# EAGLE schematic LightRetaggioSchema (EAGLE 9.6.2)
CNAME: Opto Isolator; CREVISION: 1.2; DATECODE: 20210419; DESIGNER: Daniele Palumbo
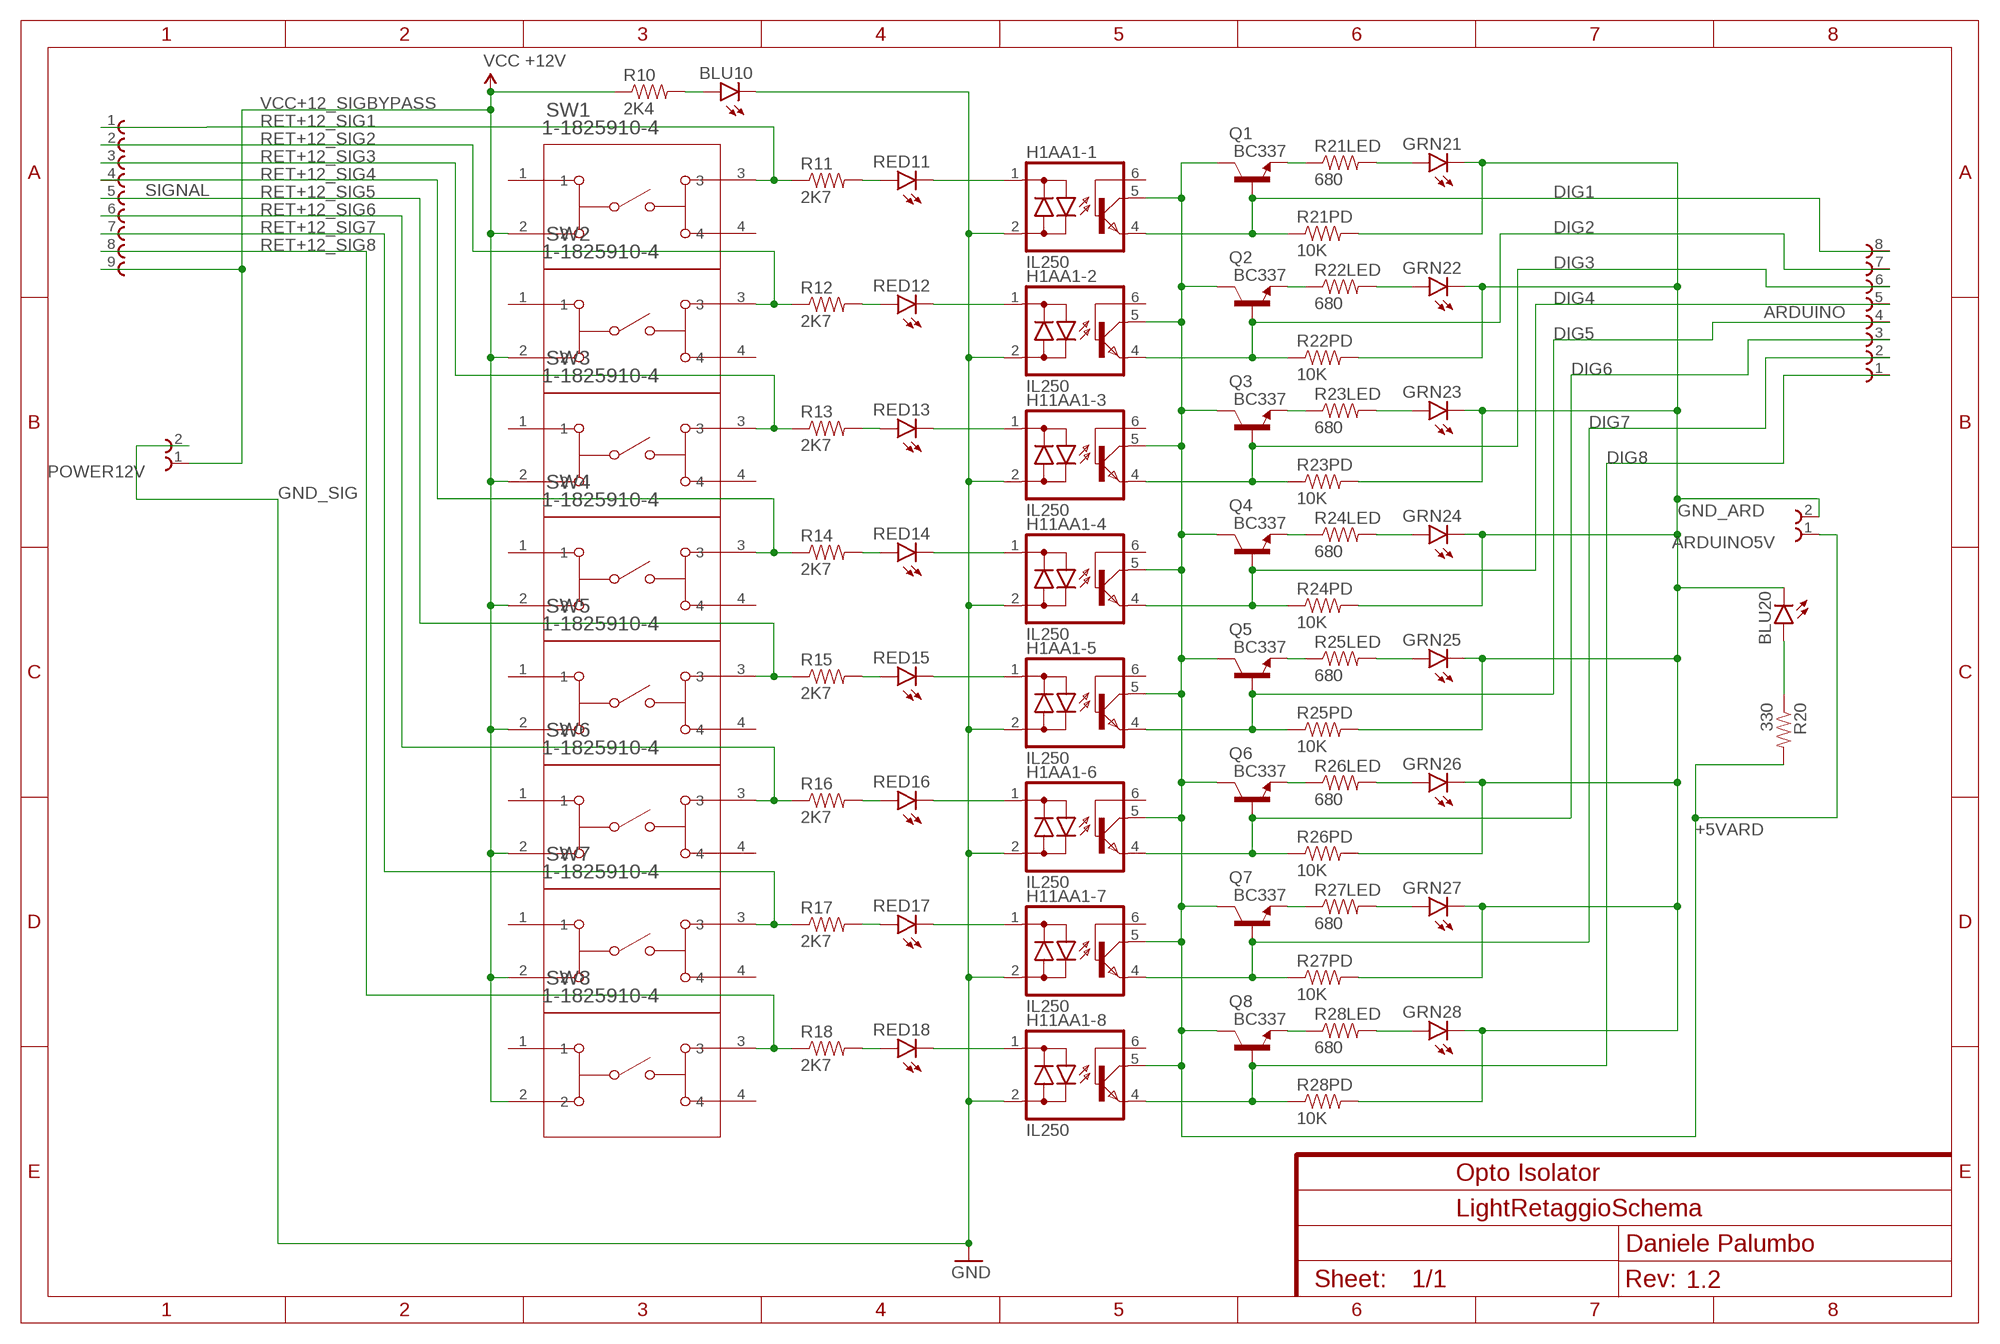
[diagram p0: schematic, sheet 1]

## Parts
ARDUINO  691311500108  [691311500108]
ARDUINO5V  691311500102  [691311500102]
BLU10  LED5MM  [LED5MM]
BLU20  LED5MM  [LED5MM]
GRN21  LED5MM  [LED5MM]
GRN22  LED5MM  [LED5MM]
GRN23  LED5MM  [LED5MM]
GRN24  LED5MM  [LED5MM]
GRN25  LED5MM  [LED5MM]
GRN26  LED5MM  [LED5MM]
GRN27  LED5MM  [LED5MM]
GRN28  LED5MM  [LED5MM]
H1AA1-1  IL250  [DIL06]
H1AA1-2  IL250  [DIL06]
H1AA1-5  IL250  [DIL06]
H1AA1-6  IL250  [DIL06]
H11AA1-3  IL250  [DIL06]
H11AA1-4  IL250  [DIL06]
H11AA1-7  IL250  [DIL06]
H11AA1-8  IL250  [DIL06]
POWER12V  691311500102  [691311500102]
Q1  BC337  TRANS_NPN-P2N2222A  [TO-92]
Q2  BC337  TRANS_NPN-P2N2222A  [TO-92]
Q3  BC337  TRANS_NPN-P2N2222A  [TO-92]
Q4  BC337  TRANS_NPN-P2N2222A  [TO-92]
Q5  BC337  TRANS_NPN-P2N2222A  [TO-92]
Q6  BC337  TRANS_NPN-P2N2222A  [TO-92]
Q7  BC337  TRANS_NPN-P2N2222A  [TO-92]
Q8  BC337  TRANS_NPN-P2N2222A  [TO-92]
R10  2K4  RESISTORPTH-1/4W  [AXIAL-0.4]
R11  2K7  RESISTORPTH-1/4W  [AXIAL-0.4]
R12  2K7  RESISTORPTH-1/4W  [AXIAL-0.4]
R13  2K7  RESISTORPTH-1/4W  [AXIAL-0.4]
R14  2K7  RESISTORPTH-1/4W  [AXIAL-0.4]
R15  2K7  RESISTORPTH-1/4W  [AXIAL-0.4]
R16  2K7  RESISTORPTH-1/4W  [AXIAL-0.4]
R17  2K7  RESISTORPTH-1/4W  [AXIAL-0.4]
R18  2K7  RESISTORPTH-1/4W  [AXIAL-0.4]
R20  330  RESISTORPTH-1/4W  [AXIAL-0.4]
R21LED  680  RESISTORPTH-1/4W  [AXIAL-0.4]
R21PD  10K  RESISTORPTH-1/4W  [AXIAL-0.4]
R22LED  680  RESISTORPTH-1/4W  [AXIAL-0.4]
R22PD  10K  RESISTORPTH-1/4W  [AXIAL-0.4]
R23LED  680  RESISTORPTH-1/4W  [AXIAL-0.4]
R23PD  10K  RESISTORPTH-1/4W  [AXIAL-0.4]
R24LED  680  RESISTORPTH-1/4W  [AXIAL-0.4]
R24PD  10K  RESISTORPTH-1/4W  [AXIAL-0.4]
R25LED  680  RESISTORPTH-1/4W  [AXIAL-0.4]
R25PD  10K  RESISTORPTH-1/4W  [AXIAL-0.4]
R26LED  680  RESISTORPTH-1/4W  [AXIAL-0.4]
R26PD  10K  RESISTORPTH-1/4W  [AXIAL-0.4]
R27LED  680  RESISTORPTH-1/4W  [AXIAL-0.4]
R27PD  10K  RESISTORPTH-1/4W  [AXIAL-0.4]
R28LED  680  RESISTORPTH-1/4W  [AXIAL-0.4]
R28PD  10K  RESISTORPTH-1/4W  [AXIAL-0.4]
RED11  LED5MM  [LED5MM]
RED12  LED5MM  [LED5MM]
RED13  LED5MM  [LED5MM]
RED14  LED5MM  [LED5MM]
RED15  LED5MM  [LED5MM]
RED16  LED5MM  [LED5MM]
RED17  LED5MM  [LED5MM]
RED18  LED5MM  [LED5MM]
SIGNAL  691311500109  [691311500109]
SW1  1-1825910-4  [SW4_1825910-D]
SW2  1-1825910-4  [SW4_1825910-D]
SW3  1-1825910-4  [SW4_1825910-D]
SW4  1-1825910-4  [SW4_1825910-D]
SW5  1-1825910-4  [SW4_1825910-D]
SW6  1-1825910-4  [SW4_1825910-D]
SW7  1-1825910-4  [SW4_1825910-D]
SW8  1-1825910-4  [SW4_1825910-D]

## Nets
+5VARD: ARDUINO5V.1 H1AA1-1.5(C) H1AA1-2.5(C) H1AA1-5.5(C) H1AA1-6.5(C) H11AA1-3.5(C) H11AA1-4.5(C) H11AA1-7.5(C) H11AA1-8.5(C) Q1.1(C) Q2.1(C) Q3.1(C) Q4.1(C) Q5.1(C) Q6.1(C) Q7.1(C) Q8.1(C) R20.P$2
DIG1: ARDUINO.8 H1AA1-1.4(E) Q1.2(B) R21PD.P$1
DIG2: ARDUINO.7 H1AA1-2.4(E) Q2.2(B) R22PD.P$1
DIG3: ARDUINO.6 H11AA1-3.4(E) Q3.2(B) R23PD.P$1
DIG4: ARDUINO.5 H11AA1-4.4(E) Q4.2(B) R24PD.P$1
DIG5: ARDUINO.4 H1AA1-5.4(E) Q5.2(B) R25PD.P$1
DIG6: ARDUINO.3 H1AA1-6.4(E) Q6.2(B) R26PD.P$1
DIG7: ARDUINO.2 H11AA1-7.4(E) Q7.2(B) R27PD.P$1
DIG8: ARDUINO.1 H11AA1-8.4(E) Q8.2(B) R28PD.P$1
GND_ARD: ARDUINO5V.2 BLU20.K(C) GRN21.K(C) GRN22.K(C) GRN23.K(C) GRN24.K(C) GRN25.K(C) GRN26.K(C) GRN27.K(C) GRN28.K(C) R21PD.P$2 R22PD.P$2 R23PD.P$2 R24PD.P$2 R25PD.P$2 R26PD.P$2 R27PD.P$2 R28PD.P$2
GND_SIG [ground]: BLU10.K(C) H1AA1-1.2(AC2) H1AA1-2.2(AC2) H1AA1-5.2(AC2) H1AA1-6.2(AC2) H11AA1-3.2(AC2) H11AA1-4.2(AC2) H11AA1-7.2(AC2) H11AA1-8.2(AC2) POWER12V.2 ; supply symbol labelled GND
N$1: BLU10.A R10.P$2
N$2: BLU20.A R20.P$1
N$3: H11AA1-8.1(AC1) RED18.K(C)
N$4: H11AA1-7.1(AC1) RED17.K(C)
N$5: H1AA1-6.1(AC1) RED16.K(C)
N$6: H1AA1-5.1(AC1) RED15.K(C)
N$7: Q1.3(E) R21LED.P$1
N$8: GRN21.A R21LED.P$2
N$9: H11AA1-4.1(AC1) RED14.K(C)
N$10: Q2.3(E) R22LED.P$1
N$11: GRN22.A R22LED.P$2
N$12: Q3.3(E) R23LED.P$1
N$13: GRN23.A R23LED.P$2
N$14: Q4.3(E) R24LED.P$1
N$15: GRN24.A R24LED.P$2
N$16: R13.P$2 RED13.A
N$17: H11AA1-3.1(AC1) RED13.K(C)
N$18: R14.P$2 RED14.A
N$19: R12.P$2 RED12.A
N$20: R11.P$2 RED11.A
N$21: R17.P$2 RED17.A
N$22: R18.P$2 RED18.A
N$23: R16.P$2 RED16.A
N$24: R15.P$2 RED15.A
N$25: Q5.3(E) R25LED.P$1
N$26: GRN25.A R25LED.P$2
N$27: Q6.3(E) R26LED.P$1
N$28: GRN26.A R26LED.P$2
N$29: Q7.3(E) R27LED.P$1
N$30: GRN27.A R27LED.P$2
N$31: Q8.3(E) R28LED.P$1
N$32: GRN28.A R28LED.P$2
N$33: H1AA1-2.1(AC1) RED12.K(C)
N$34: H1AA1-1.1(AC1) RED11.K(C)
RET+12_SIG1: R11.P$1 SIGNAL.1 SW1.3
RET+12_SIG2: R12.P$1 SIGNAL.2 SW2.3
RET+12_SIG3: R13.P$1 SIGNAL.3 SW3.3
RET+12_SIG4: R14.P$1 SIGNAL.4 SW4.3
RET+12_SIG5: R15.P$1 SIGNAL.5 SW5.3
RET+12_SIG6: R16.P$1 SIGNAL.6 SW6.3
RET+12_SIG7: R17.P$1 SIGNAL.7 SW7.3
RET+12_SIG8: R18.P$1 SIGNAL.8 SW8.3
VCC+12_SIGBYPASS [power]: POWER12V.1 R10.P$1 SIGNAL.9 SW1.2 SW2.2 SW3.2 SW4.2 SW5.2 SW6.2 SW7.2 SW8.2 ; supply symbol labelled VCC +12V
Unconnected: H1AA1-1.6(B) H1AA1-2.6(B) H1AA1-5.6(B) H1AA1-6.6(B) H11AA1-3.6(B) H11AA1-4.6(B) H11AA1-7.6(B) H11AA1-8.6(B) SW1.1 SW1.4 SW2.1 SW2.4 SW3.1 SW3.4 SW4.1 SW4.4 SW5.1 SW5.4 SW6.1 SW6.4 SW7.1 SW7.4 SW8.1 SW8.4

## Library data of the parts
ARDUINO = Wurth_Elektronik_Electromechanic_Terminal_Blocks_Connectors_rev19d:691311500108: WR-TBL Serie 311 - 5.08 mm Close Vertical PCB Header , 8 Pins=>Code : Con_TBL_Pluggable_5.08_PCB_THT_Simple_V_691311500108 <http://katalog.we-online.de/media/images/eican/Con_TBL_Pluggable_5.08_PCB_THT_Simple_V_6913115001xx_pf2.jpg> Details see: http://katalog.we-online.de/en/em/TBL_5_08_311_CLOSE_VERTICAL_PCB_HEADER_6913115001XX Created 2014-06-23, Karrer Zheng 2014 (C) Würth Elektronik; OC_FARNELL: unknown
ARDUINO5V POWER12V = Wurth_Elektronik_Electromechanic_Terminal_Blocks_Connectors_rev19d:691311500102: WR-TBL Serie 311 - 5.08 mm Close Vertical PCB Header , 2 Pins=>Code : Con_TBL_Pluggable_5.08_PCB_THT_Simple_V_691311500102 <http://katalog.we-online.de/media/images/eican/Con_TBL_Pluggable_5.08_PCB_THT_Simple_V_6913115001xx_pf2.jpg> Details see: http://katalog.we-online.de/en/em/TBL_5_08_311_CLOSE_VERTICAL_PCB_HEADER_6913115001XX Created 2014-06-23, Karrer Zheng 2014 (C) Würth Elektronik; MF: WURTH ELEKTRONIK; MPN: 691311500102; OC_FARNELL: 1641978
BLU10 BLU20 GRN21-GRN28 RED11-RED18 = led:LED: LED OSRAM: - CHIPLED LG R971, LG N971, LY N971, LG Q971, LY Q971, LO R971, LY R971 LH N974, LH R974 LS Q976, LO Q976, LY Q976 LO Q996 - Hyper CHIPLED LW Q18S LB Q993, LB Q99A, LB R99A - SideLED LS A670, LO A670, LY A670, LG A670, LP A670 LB A673, LV A673, LT A673, LW A673 LH A674 LY A675 LS A676, LA A676, LO A676, LY A676, LW A676 LS A679, LY A679, LG A679 - Hyper Micro SIDELED® LS Y876, LA Y876, LO Y876, LY Y876 LT Y87S - SmartLED LW L88C, LW L88S LB L89C, LB L89S, LG L890 LS L89K, LO L89K, LY L89K LS L896, LA L896, LO L896, LY L896 - TOPLED LS T670, LO T670, LY T670, LG T670, LP T670 LSG T670, LSP T670, LSY T670, LOP T670, LYG T670 LG T671, LOG T671, LSG T671 LB T673, LV T673, LT T673, LW T673 LH T674 LS T676, LA T676, LO T676, LY T676, LB T676, LH T676, LSB T676, LW T676 LB T67C, LV T67C, LT T67C, LS T67K, LO T67K, LY T67K, LW E67C LS E67B, LA E67B, LO E67B, LY E67B, LB E67C, LV E67C, LT E67C LW T67C LS T679, LY T679, LG T679 LS T770, LO T770, LY T770, LG T770, LP T770 LB T773, LV T773, LT T773, LW T773 LH T774 LS E675, LA E675, LY E675, LS T675 LS T776, LA T776, LO T776, LY T776, LB T776 LHGB T686 LT T68C, LB T68C - Hyper Mini TOPLED® LB M676 - Mini TOPLED Santana® LG M470 LS M47K, LO M47K, LY M47K Source: http://www.osram.convergy.de LUXEON: - LUMILED® LXK2-PW12-R00, LXK2-PW12-S00, LXK2-PW14-U00, LXK2-PW14-V00 LXK2-PM12-R00, LXK2-PM12-S00, LXK2-PM14-U00 LXK2-PE12-Q00, LXK2-PE12-R00, LXK2-PE12-S00, LXK2-PE14-T00, LXK2-PE14-U00 LXK2-PB12-K00, LXK2-PB12-L00, LXK2-PB12-M00, LXK2-PB14-N00, LXK2-PB14-P00, LXK2-PB14-Q00 LXK2-PR12-L00, LXK2-PR12-M00, LXK2-PR14-Q00, LXK2-PR14-R00 LXK2-PD12-Q00, LXK2-PD12-R00, LXK2-PD12-S00 LXK2-PH12-R00, LXK2-PH12-S00 LXK2-PL12-P00, LXK2-PL12-Q00, LXK2-PL12-R00 Source: www.luxeon.com KINGBRIGHT: KA-3528ASYC Source: www.kingbright.com; MF: ALCOSWITCH - TE CONNECTIVITY; MPN: FSM8JH; OC_FARNELL: 1555985
H1AA1-1 H1AA1-2 H1AA1-5 H1AA1-6 H11AA1-3 H11AA1-4 H11AA1-7 H11AA1-8 = optocoupler:IL250: SIEMENS OPTO COUPLER; MF: VISHAY/TELEFUNKEN; MPN: IL250; OC_FARNELL: unknown; OC_NEWARK: 58K1705
Q1-Q8 = SparkFun-DiscreteSemi:TRANS_NPN: NPN transistor Current controlled devices typically used to amplify current or used as a switch. BC547 - COM-08928 <http://www.sparkfun.com/products/8928> (TO-92 45V 100mA) (1.Collector 2.Base 3.Emitter) 2N3904 - COM-00521 <http://www.sparkfun.com/products/521> (TO-92 40V 200mA) (1.Emitter 2.Base 3.Collector) P2N2222A - COM-12852 <http://www.sparkfun.com/products/12852> (TO-92 40V 600mA) (1.Collector 2.Base 3.Emitter); OC_FARNELL: unknown; PROD_ID: TRANS-09536; VALUE: 600mA/40V
R10-R18 R20 R21LED R21PD R22LED R22PD R23LED R23PD R24LED R24PD R25LED R25PD R26LED R26PD R27LED R27PD R28LED R28PD = SparkFun-Passives:RESISTOR: Resistor Basic schematic elements and footprints for 0603, 1206, and PTH resistors.; OC_FARNELL: unknown
SIGNAL = Wurth_Elektronik_Electromechanic_Terminal_Blocks_Connectors_rev19d:691311500109: WR-TBL Serie 311 - 5.08 mm Close Vertical PCB Header , 9 Pins=>Code : Con_TBL_Pluggable_5.08_PCB_THT_Simple_V_691311500109 <http://katalog.we-online.de/media/images/eican/Con_TBL_Pluggable_5.08_PCB_THT_Simple_V_6913115001xx_pf2.jpg> Details see: http://katalog.we-online.de/en/em/TBL_5_08_311_CLOSE_VERTICAL_PCB_HEADER_6913115001XX Created 2014-06-23, Karrer Zheng 2014 (C) Würth Elektronik; OC_FARNELL: unknown
SW1-SW8 = Switches:1-1825910-4; BUILT_BY: EMA_UL_Team; CATEGORY: Tactile Switches; CONFIGURATION__POLE-THROW_: Single Pole - Single Throw; COPYRIGHT: Copyright (C) 2016 Accelerated Designs. All rights reserved; DESCRIPTION: FSM8JH=6MM TACT SWITCH, HIGH TEMP; MANUFACTURER_PART_NUMBER: 1-1825910-4; MAX_SWITCHING_CURRENT: -; MAX_SWITCHING_VOLTAGE_AC_: -; OC_FARNELL: unknown; PART_STATUS: active; PRODUCT_TYPE: Switch; SERIES: Unknown; SWITCH_TYPE: Tactile Switches; TE_PART_NUMBER: 1-1825910-4; VENDOR: TE Connectivity

## Net classes
0 default: width 0.305 mm, clearance 0.152 mm
1 ground: width 0.61 mm, clearance 0.305 mm
2 power: width 0.61 mm, clearance 0.305 mm